# EAGLE design MB128_tester_PCB (EAGLE 9.4.0)
PC Engine Joypad Breakout Version 1.0
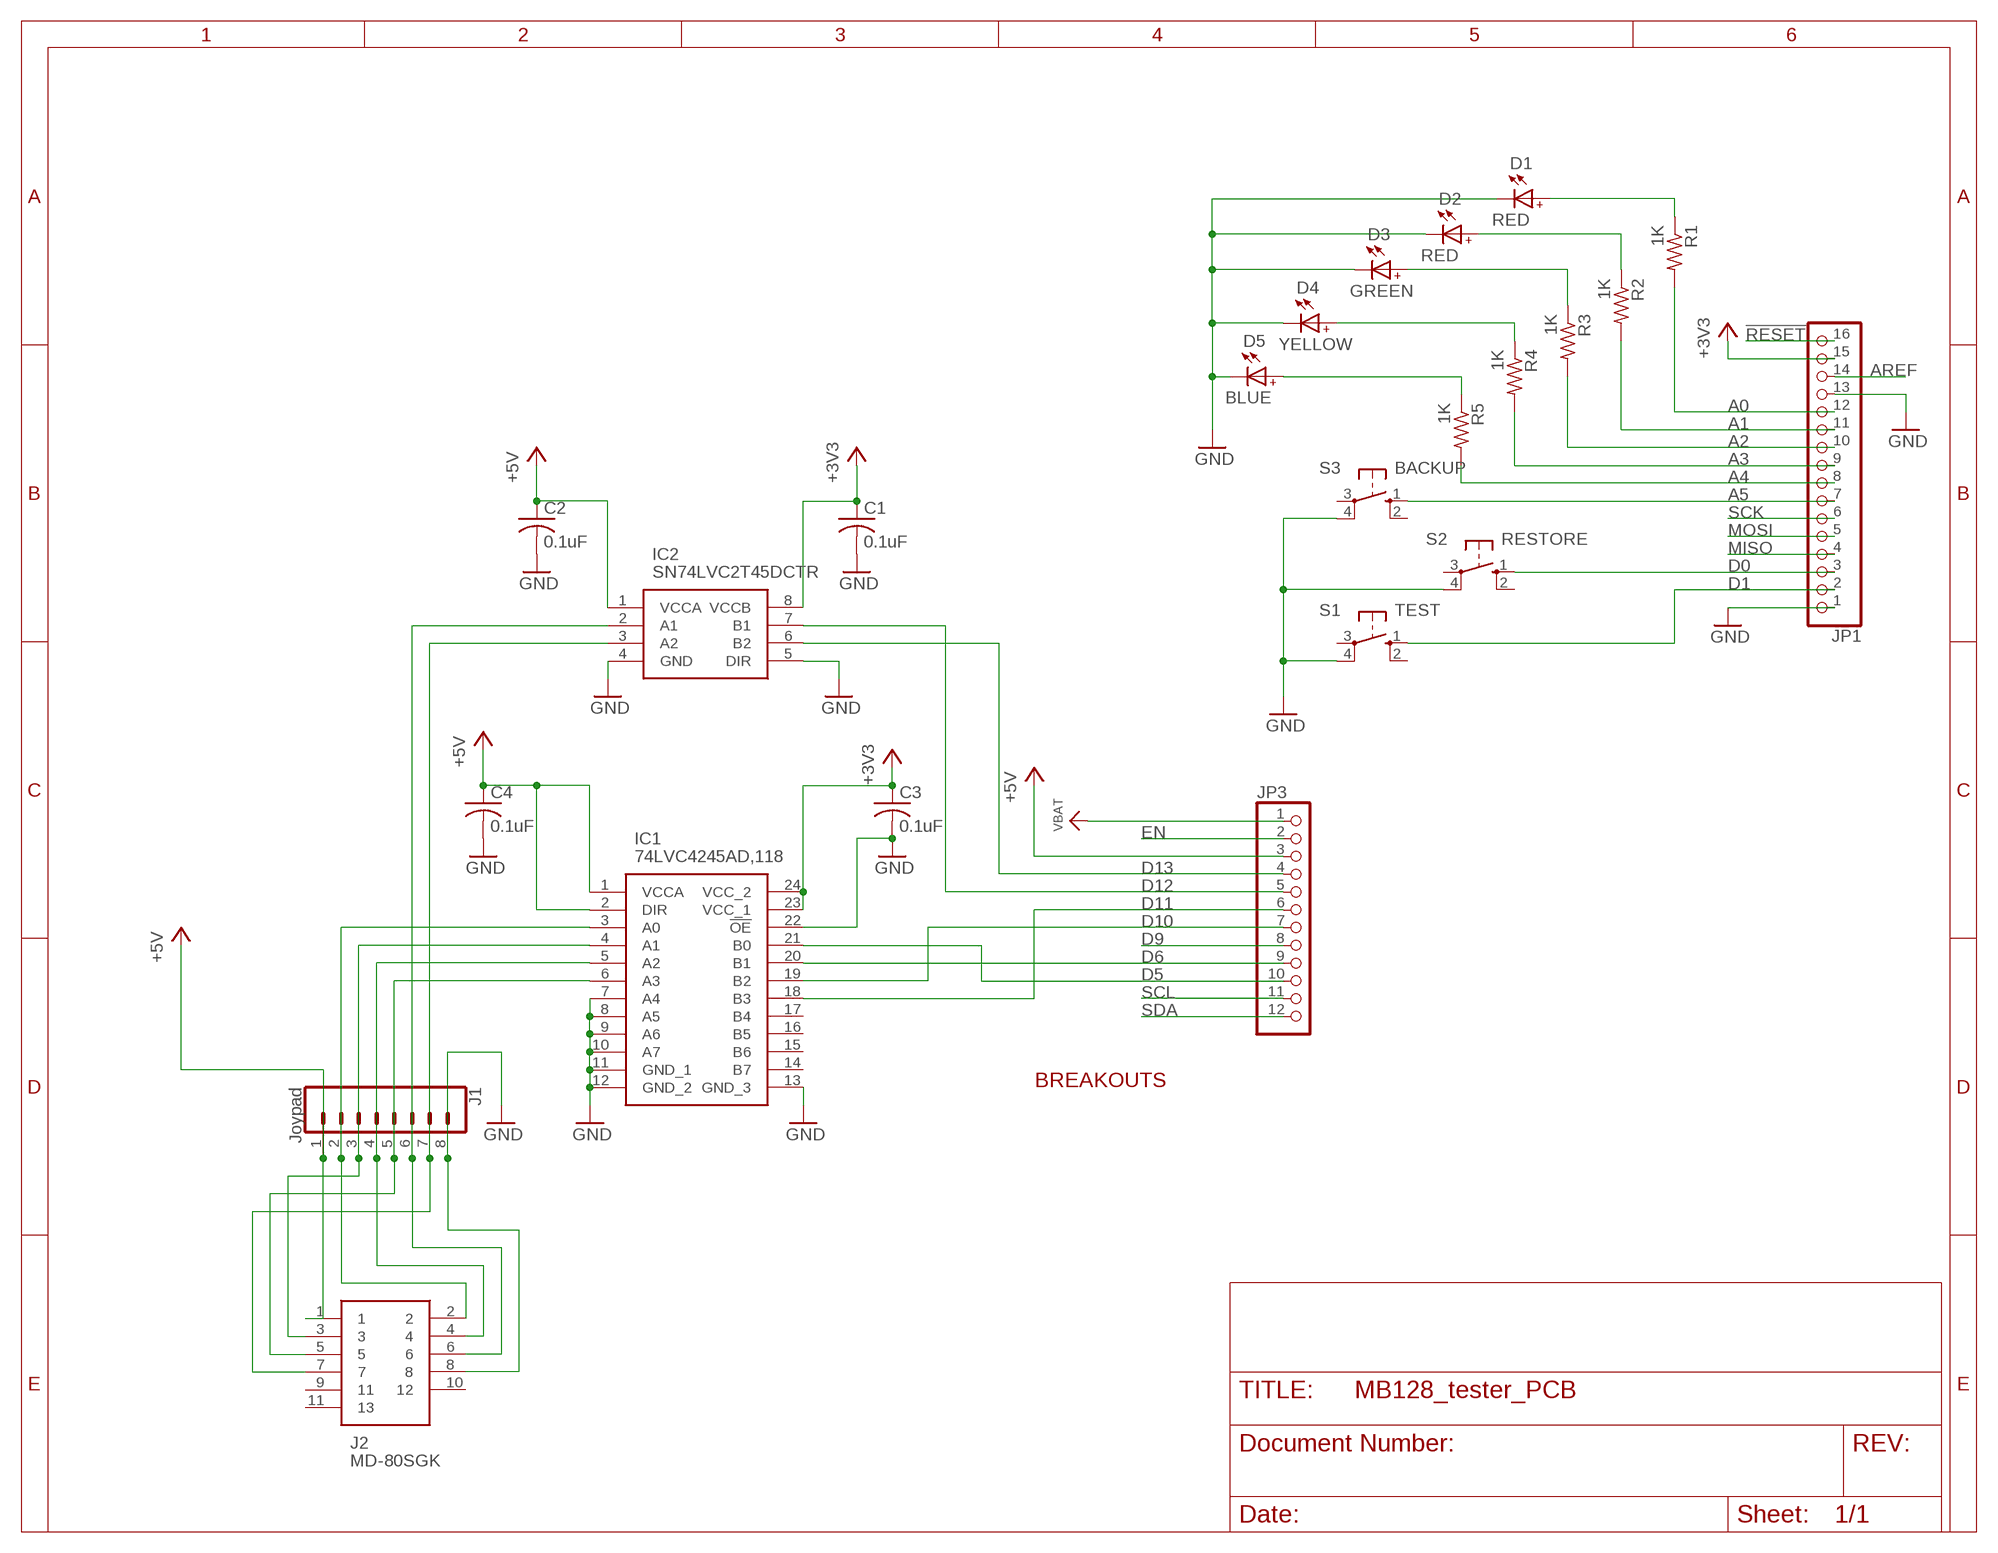
[diagram p0: schematic, sheet 1]

## Parts
C1  0.1uF  C-USC0805  [C0805]
C2  0.1uF  C-USC0805  [C0805]
C3  0.1uF  C-USC0805  [C0805]
C4  0.1uF  C-USC0805  [C0805]
D1  RED  WL-SMCC_0603_R/V/Y_150060RS73220  [WL-SMCC_0603_R/Y/V]
D2  RED  WL-SMCC_0603_R/V/Y_150060RS73220  [WL-SMCC_0603_R/Y/V]
D3  GREEN  WL-SMCC_0603_R/V/Y_150060RS73220  [WL-SMCC_0603_R/Y/V]
D4  YELLOW  WL-SMCC_0603_R/V/Y_150060RS73220  [WL-SMCC_0603_R/Y/V]
D5  BLUE  WL-SMCC_0603_R/V/Y_150060RS73220  [WL-SMCC_0603_R/Y/V]
IC1  74LVC4245AD,118  [SOIC127P1032X265-24N]
IC2  SN74LVC2T45DCTR  [SOP65P400X130-8N]
J1  Joypad  CONN_08"  [1X08]
J2  MD-80SGK  [MD80SGK]
JP1  HEADER-1X16ROUND  [1X16_ROUND]
JP3  HEADER-1X12  [1X12_ROUND]
R1  1K  R-US_R0603  [R0603]
R2  1K  R-US_R0603  [R0603]
R3  1K  R-US_R0603  [R0603]
R4  1K  R-US_R0603  [R0603]
R5  1K  R-US_R0603  [R0603]
S1  TEST  10-XX  [B3F-10XX]
S2  RESTORE  10-XX  [B3F-10XX]
S3  BACKUP  10-XX  [B3F-10XX]

## Nets
!RESET: JP1.16
+3V3 [power]: C1.1 C3.1 IC1.23(VCC_1) IC1.24(VCC_2) IC2.8(VCCB) JP1.15
+5V [power]: C2.1 C4.1 IC1.1(VCCA) IC1.2(DIR) IC2.1(VCCA) J1.1 J2.1 JP3.3
A0: JP1.12 R1.2
A1: JP1.11 R2.2
A2: JP1.10 R3.2
A3: JP1.9 R4.2
A4: JP1.8 R5.2
A5: JP1.7 S3.1(S)
AREF: JP1.14
D0: JP1.3 S2.1(S)
D1: JP1.2 S1.1(S)
D5 [signal]: IC1.21(B0) JP3.10
D6 [signal]: IC1.20(B1) JP3.9
D9: JP3.8
D10 [signal]: IC1.19(B2) JP3.7
D11 [signal]: IC1.18(B3) JP3.6
D12 [signal]: IC2.7(B1) JP3.5
D13 [signal]: IC2.6(B2) JP3.4
EN: JP3.2
GND [power]: C1.2 C2.2 C3.2 C4.2 D1.1(C) D2.1(C) D3.1(C) D4.1(C) D5.1(C) IC1.7(A4) IC1.8(A5) IC1.9(A6) IC1.10(A7) IC1.11(GND_1) IC1.12(GND_2) IC1.13(GND_3) IC1.22(!OE) IC2.4(GND) IC2.5(DIR) J1.8 J2.8 JP1.1 JP1.13 S1.4(P1) S2.4(P1) S3.4(P1)
MISO: JP1.4
MOSI: JP1.5
N$1: D1.2(A) R1.1
N$2 [signal]: IC1.4(A1) J1.3 J2.3
N$3 [signal]: IC1.3(A0) J1.2 J2.2
N$4 [signal]: IC1.5(A2) J1.4 J2.4
N$5 [signal]: IC1.6(A3) J1.5 J2.5
N$6 [signal]: IC2.2(A1) J1.6 J2.6
N$7 [signal]: IC2.3(A2) J1.7 J2.7
N$8: D2.2(A) R2.1
N$9: D3.2(A) R3.1
N$10: D4.2(A) R4.1
N$11: D5.2(A) R5.1
SCK: JP1.6
SCL: JP3.11
SDA: JP3.12
VBAT: JP3.1
Unconnected: IC1.14(B7) IC1.15(B6) IC1.16(B5) IC1.17(B4) J2.9 J2.10 J2.11 S1.2(S1) S1.3(P) S2.2(S1) S2.3(P) S3.2(S1) S3.3(P)

## Notes on the sheet
- BREAKOUTS

## Library data of the parts
C1-C4 = resistor:C-US: CAPACITOR, American symbol
D1-D5 = Wurth_Elektronik_Optoelectronics_rev19a:WL-SMCC_0603_R/V/Y: WL-SMCC SMD Mono-color Chip LED Compact Characteristics Compatible to IR reflow soldering Miniaturized color effect Size 0603 Industrial platform – 1.6 x 0.8 mm Ultra thin 0.2 mm PCB based Temperature Tj = 115°C / 125°C Applications Size 0603 Office Automation Home appliances Industrial equipment Industrial switches and button backlighting Dashboards Entertainment consoles Small pixel indoor signs <http://katalog.we-online.de/media/images/v2/Family_WL-SMCC_neu.jpg> Details see: http://katalog.we-online.de/en/led/WL-SMCC?m Created By Yingchun Shan 2018-03-09 2018 (C) Wurth Elektronik
IC1 = SamacSys_Parts:74LVC4245AD,118: NEXPERIA - 74LVC4245AD,118 - TRANSCEIVER, NON-INVERTING, SOIC-24 Source: Datasheet <https://assets.nexperia.com/documents/data-sheet/74LVC4245A.pdf>; DESCRIPTION: NEXPERIA - 74LVC4245AD,118 - TRANSCEIVER, NON-INVERTING, SOIC-24; HEIGHT: 2.65mm; MANUFACTURER_NAME: Nexperia; MANUFACTURER_PART_NUMBER: 74LVC4245AD,118; MOUSER_PART_NUMBER: 771-74LVC4245AD-T; MOUSER_PRICE-STOCK: https://www.mouser.com/Search/Refine.aspx?Keyword=771-74LVC4245AD-T; RS_PART_NUMBER: 1708039; RS_PRICE-STOCK: http://uk.rs-online.com/web/p/products/1708039
IC2 = SamacSys_Parts:SN74LVC2T45DCTR: 2-Bit Bus Transceiver, Translation SSOP8 SN74LVC2T45DCTR, Voltage Level Translator, Bus Transceiver LVC, 3-State 1.65 Source: Datasheet <http://www.ti.com/lit/ds/symlink/sn74lvc2t45.pdf>; DESCRIPTION: 2-Bit Bus Transceiver, Translation SSOP8 SN74LVC2T45DCTR, Voltage Level Translator, Bus Transceiver LVC, 3-State 1.65; HEIGHT: 1.3mm; MANUFACTURER_NAME: Texas Instruments; MANUFACTURER_PART_NUMBER: SN74LVC2T45DCTR; MOUSER_PART_NUMBER: 595-SN74LVC2T45DCTR; MOUSER_PRICE-STOCK: https://www.mouser.com/Search/Refine.aspx?Keyword=595-SN74LVC2T45DCTR; RS_PART_NUMBER: 9213022; RS_PRICE-STOCK: http://uk.rs-online.com/web/p/products/9213022
J1 = SparkFun-Connectors:CONN_08: Multi connection point. Often used as Generic Header-pin footprint for 0.1 inch spaced/style header connections On any of the 0.1 inch spaced packages, you can populate with these: Break Away Headers - Straight <https://www.sparkfun.com/products/116> (PRT-00116) Break Away Male Headers - Right Angle <https://www.sparkfun.com/products/553> (PRT-00553) Female Headers <https://www.sparkfun.com/products/115> (PRT-00115) Break Away Headers - Machine Pin <https://www.sparkfun.com/products/117> (PRT-00117) Break Away Female Headers - Swiss Machine Pin <https://www.sparkfun.com/products/743> (PRT-00743) Arduino Stackable Header - 8 Pin <https://www.sparkfun.com/products/9279> (PRT-09279) For SCREWTERMINALS and SPRING TERMINALS visit here: Screw Terimnals on SparkFun.com <https://www.sparkfun.com/search/results?term=Screw+Terminals> (5mm/3.5mm/2.54mm spacing) This device is also useful as a general connection point to wire up your design to another part of your project. Our various solder wires solder well into these plated through hole pads. Hook-Up Wire - Assortment (Stranded, 22 AWG) <https://www.sparkfun.com/products/11375> (PRT-11375) Hook-Up Wire - Assortment (Solid Core, 22 AWG) <https://www.sparkfun.com/products/11367> (PRT-11367) View the entire wire category on our website here <https://www.sparkfun.com/categories/141> Special notes: Molex polarized connector foot print use with SKU : PRT-08231 with associated crimp pins and housings. 1MM SMD Version SKU: PRT-10208 NOTES ON THE VARIANTS LOCK and LOCK_LONGPADS... This footprint was designed to help hold the alignment of a through-hole component (i.e. 6-pin header) while soldering it into place. You may notice that each hole has been shifted either up or down by 0.005 of an inch from it's more standard position (which is a perfectly straight line). This slight alteration caused the pins (the squares in the middle) to touch the edges of the holes. Because they are alternating, it causes a "brace" to hold the component in place. 0.005 has proven to be the perfect amount of "off-center" position when using our standard breakaway headers. Although looks a little odd when you look at the bare footprint, once you have a header in there, the alteration is very hard to notice. Also,if you push a header all the way into place, it is covered up entirely on the bottom side.; PROD_ID: CONN-08438
J2 = SamacSys_Parts:MD-80SGK: Circular DIN Connectors mini-DIN, 8P jack, rt, through hole, full shield Source: Datasheet <https://www.cui.com/product/resource/md-sgk-series.pdf>; DESCRIPTION: Circular DIN Connectors mini-DIN, 8P jack, rt, through hole, full shield; HEIGHT: 13mm; MANUFACTURER_NAME: CUI; MANUFACTURER_PART_NUMBER: MD-80SGK; MOUSER_PART_NUMBER: 490-MD-80SGK; MOUSER_PRICE-STOCK: https://www.mouser.com/Search/Refine.aspx?Keyword=490-MD-80SGK
JP1 = microbuilder:HEADER-1X16: PIN HEADER
JP3 = microbuilder:HEADER-1X12
R1-R5 = resistor:R-US_: RESISTOR, American symbol
S1-S3 = switch-omron:10-XX: OMRON SWITCH; MPN: B3F-1000; OC_FARNELL: 176432; OC_NEWARK: 36M3542

## Net classes
0 default: width 0.152 mm, drill 0.356 mm, clearance 0.152 mm
1 power: width 0.203 mm, drill 0.356 mm, clearance 0.152 mm
2 signal: width 0.152 mm, drill 0.356 mm, clearance 0.152 mm

## Board
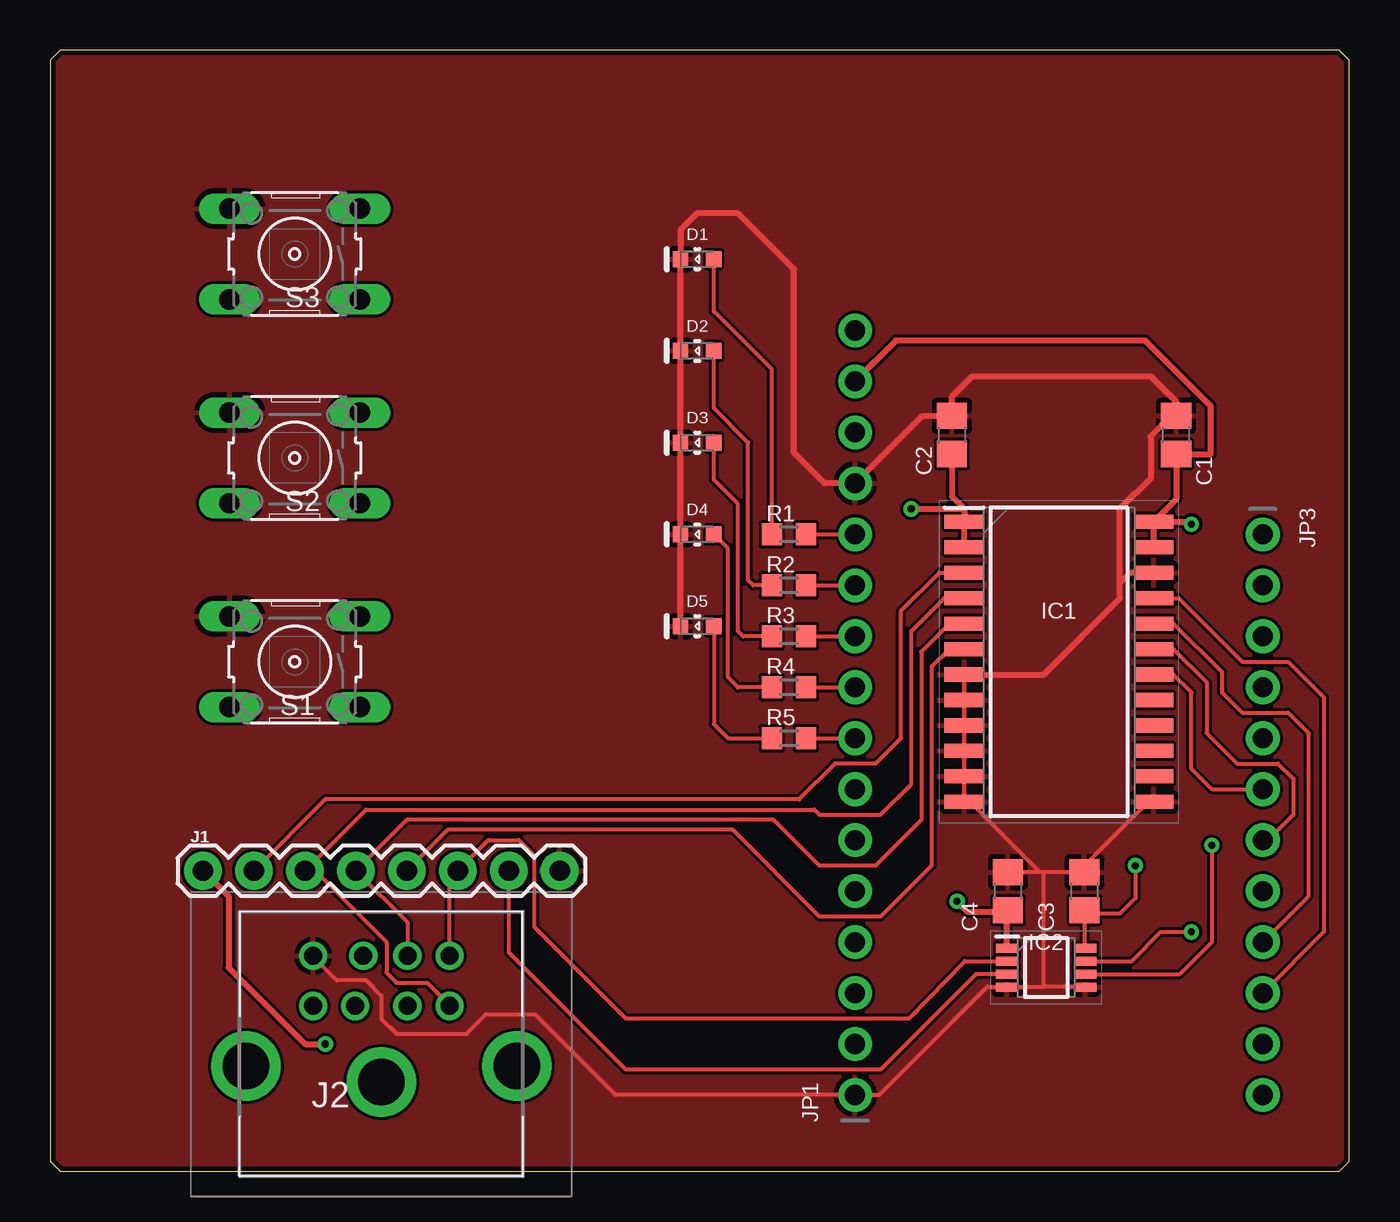
[diagram p1: board, top side]
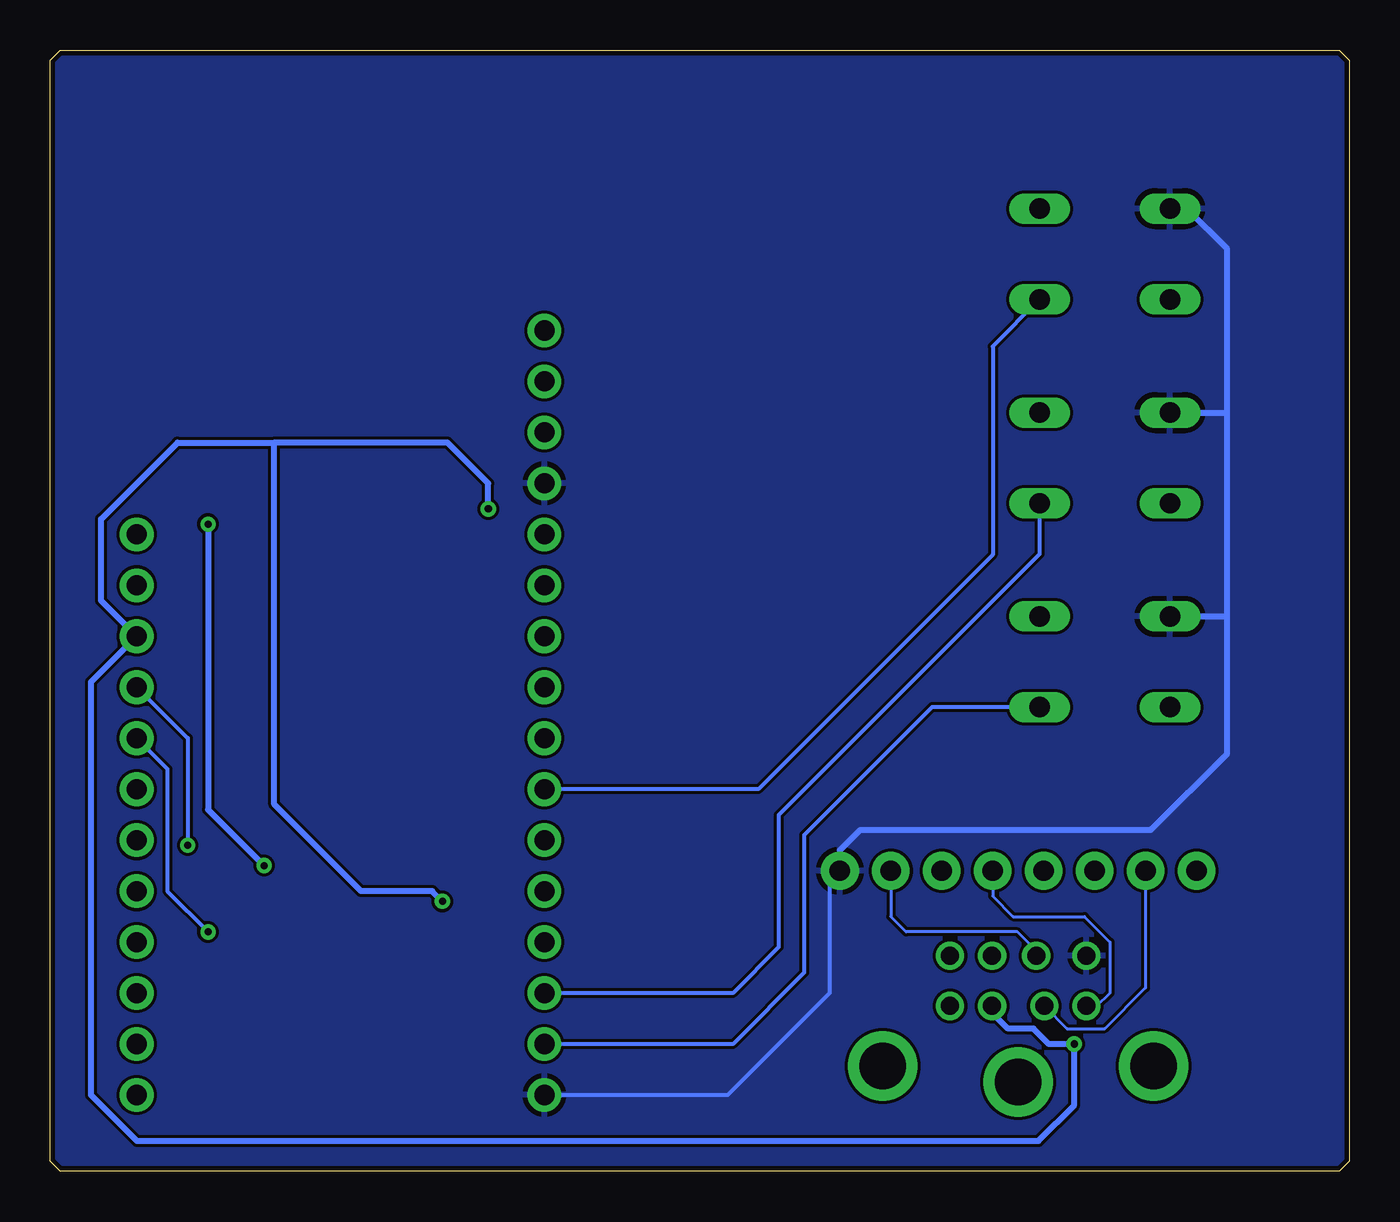
[diagram p2: board, bottom side, seen from below]

Size 64.77 x 55.88 mm. Coordinates in mm from the lower left corner, seen from the top.
Outline: 0,55.37 0,0.51 0.51,0 64.26,0 64.77,0.51 64.77,55.37 64.26,55.88 0.51,55.88 0,55.37
Copper layers (1*16): Top 0.035mm / dielectric 1.5mm / Bottom 0.035mm
Design rules "default *": minimum track width 6mil, minimum drill 0.35mm, track to track 6mil, track to pad 6mil, pad to pad 6mil, via to via 6mil, smd to smd 6mil, copper to edge 10mil, drill to drill 6mil, minimum pad ring 10mil, minimum via ring 8mil, stop-mask expansion 6mil, vias tented up to drill 0mil, thermal gap 10mil

### Footprints (pad centres in the part's own frame; a part is rotated, then mirrored left to right if it is on the bottom)
C0805 = smd 1.3 x 1.5: 1 -0.95,0; 2 0.95,0
WL-SMCC_0603_R/Y/V = smd 0.75 x 0.8: 1 -0.825,0; 2 0.825,0
SOIC127P1032X265-24N = smd 1.95 x 0.7: 1 -4.725,6.985; 2 -4.725,5.715; 3 -4.725,4.445; 4 -4.725,3.175; 5 -4.725,1.905; 6 -4.725,0.635; 7 -4.725,-0.635; 8 -4.725,-1.905; 9 -4.725,-3.175; 10 -4.725,-4.445; 11 -4.725,-5.715; 12 -4.725,-6.985; 13 4.725,-6.985; 14 4.725,-5.715; 15 4.725,-4.445; 16 4.725,-3.175; 17 4.725,-1.905; 18 4.725,-0.635; 19 4.725,0.635; 20 4.725,1.905; 21 4.725,3.175; 22 4.725,4.445; 23 4.725,5.715; 24 4.725,6.985
SOP65P400X130-8N = smd 1.1 x 0.45: 1 -1.95,0.975; 2 -1.95,0.325; 3 -1.95,-0.325; 4 -1.95,-0.975; 5 1.95,-0.975; 6 1.95,-0.325; 7 1.95,0.325; 8 1.95,0.975
1X08 = drill 1.016 pad 1.88: 1 0,0; 2 2.54,0; 3 5.08,0; 4 7.62,0; 5 10.16,0; 6 12.7,0; 7 15.24,0; 8 17.78,0
MD80SGK = drill 0.9 pad 1.4: 1 -1.3,-1.9; 2 1.3,-1.9; 3 -3.4,-1.9; 4 -1.3,-4.4; 5 3.4,-1.9; 6 -3.4,-4.4; 7 0.9,-4.4; 8 3.4,-4.4 | drill 2.309 pad 3.463: 9 0,1.9; 10 -6.75,1.1; 11 6.75,1.1
1X16_ROUND = drill 1 pad 1.676: 1 -19.05,0; 2 -16.51,0; 3 -13.97,0; 4 -11.43,0; 5 -8.89,0; 6 -6.35,0; 7 -3.81,0; 8 -1.27,0; 9 1.27,0; 10 3.81,0; 11 6.35,0; 12 8.89,0; 13 11.43,0; 14 13.97,0; 15 16.51,0; 16 19.05,0
1X12_ROUND = drill 1 pad 1.676: 1 -13.97,0; 2 -11.43,0; 3 -8.89,0; 4 -6.35,0; 5 -3.81,0; 6 -1.27,0; 7 1.27,0; 8 3.81,0; 9 6.35,0; 10 8.89,0; 11 11.43,0; 12 13.97,0
R0603 = smd 1 x 1.1: 1 -0.85,0; 2 0.85,0
B3F-10XX = drill 1.016 long: 1 -3.251,2.261; 2 3.251,2.261; 3 -3.251,-2.261; 4 3.251,-2.261

### Placement (x,y rotation side)
C1  56.13,36.7 90 top
C2  44.96,36.7 90 top
C3  51.56,13.97 90 top
C4  47.75,13.97 90 top
D1  32.26,45.47 0 top
D2  32.26,40.89 0 top
D3  32.26,36.32 0 top
D4  32.26,31.75 0 top
D5  32.26,27.18 0 top
IC1  50.29,25.4 0 top
IC2  49.66,10.16 0 top
J1  7.62,14.99 0 top
J2  16.51,6.35 180 top
JP1  40.13,22.86 90 top
JP3  60.45,17.78 270 top
R1  36.83,31.75 0 top
R2  36.83,29.21 0 top
R3  36.83,26.67 0 top
R4  36.83,24.13 0 top
R5  36.83,21.59 0 top
S1  12.19,25.4 180 top
S2  12.19,35.56 180 top
S3  12.19,45.72 180 top

### Tracks (layer width: path | path; a pad name or v marks a point on that pad's centre or on a via)
+3V3  (via drill 0.36)
  Top 0.203: IC2.8 51.56,11.11 C3.1 51.73,12.85 53.34,12.85 54.1,13.61 v54.1,15.24
  Top 0.305: v56.9,32.26 56.77,32.38 IC1.24 | JP1.15 42.16,41.4 54.61,41.4 57.85,38.16 57.85,35.75 C1.1 56.13,33.5 IC1.24 | IC1.23 IC1.24
  Bottom 0.305: v54.1,15.24 56.9,18.03 v56.9,32.26
+5V  (via drill 0.36)
  Top 0.305: 45.57,33.02 IC1.1 IC1.2 | v42.93,33.02 45.57,33.02 | v13.72,6.35 12.7,6.35 8.89,10.16 8.89,13.72 J1.1 | v45.21,13.46 45.72,12.95 47.69,12.95 | 47.69,12.95 C4.1 | IC2.1 47.71,12.93 47.69,12.95 | 45.57,33.02 44.96,33.63 C2.1
  Bottom 0.305: 53.59,36.32 58.42,36.32 62.23,32.51 62.23,28.45 JP3.3 62.74,24.38 62.74,3.81 60.45,1.52 15.49,1.52 13.72,3.3 v13.72,6.35 14.99,6.35 15.75,7.11 17.02,7.11 17.81,7.9 J2.1 | v45.21,13.46 45.72,13.97 49.28,13.97 53.59,18.29 53.59,36.32 | v42.93,33.02 42.93,34.29 44.96,36.32 53.59,36.32
A0
  Top 0.203: R1.2 JP1.12
A1
  Top 0.203: R2.2 JP1.11
A2
  Top 0.203: R3.2 JP1.10
A3
  Top 0.203: R4.2 JP1.9
A4
  Top 0.203: R5.2 JP1.8
A5
  Bottom 0.203: S3.1 17.78,41.12 17.78,30.73 29.46,19.05 JP1.7
D0
  Bottom 0.203: S2.1 15.44,30.76 28.45,17.75 28.45,11.18 30.73,8.89 JP1.3
D1
  Bottom 0.203: S1.1 20.8,23.14 27.18,16.76 27.18,9.91 30.73,6.35 JP1.2
D5
  Top 0.203: IC1.21 56.26,28.57 59.44,25.4 61.72,25.4 63.5,23.62 63.5,11.94 JP3.10
D6
  Top 0.203: IC1.20 56.01,27.3 58.42,24.89 58.42,23.88 59.44,22.86 61.72,22.86 62.74,21.84 62.74,13.72 JP3.9
D10
  Top 0.203: IC1.19 56.01,26.04 57.66,24.38 57.66,21.84 59.18,20.32 61.21,20.32 61.98,19.56 61.98,17.78 60.71,16.51 JP3.7
D11
  Top 0.203: JP3.6 57.91,19.05 56.9,20.07 56.9,23.88 56.01,24.77 IC1.18
D12  (via drill 0.36)
  Top 0.203: v56.9,11.94 55.37,11.94 53.92,10.48 IC2.7
  Bottom 0.203: JP3.5 58.93,20.07 58.93,13.97 v56.9,11.94
D13  (via drill 0.36)
  Top 0.203: v57.91,16.26 57.91,11.43 56.32,9.84 IC2.6
  Bottom 0.203: JP3.4 57.91,21.59 v57.91,16.26
GND
  Top 0.203: 51.24,14.92 C3.2 51.24,14.92 | 51.24,14.92 49.53,14.92 | 49.53,14.92 49.34,14.92 | 49.34,14.92 C4.2 | 51.24,14.92 54.74,18.41 IC1.13 | 49.34,14.92 45.85,18.41 IC1.12 IC1.11 IC1.10 IC1.9 IC1.8 IC1.7 | 49.53,9.21 51.56,9.21 IC2.5 | 49.53,9.21 47.75,9.21 IC2.4 47.43,9.21 46.74,9.21 41.34,3.81 JP1.1 28.19,3.81 24.19,7.81 21.72,7.81 20.77,6.86 17.27,6.86 16.51,7.62 16.51,8.76 15.75,9.53 14.29,9.53 13.34,10.48 J2.8 | 49.53,9.21 49.53,14.92
  Top 0.305: 53.34,29.34 53.85,29.84 IC1.22 | 53.34,29.34 53.34,28.57 49.53,24.77 IC1.7 | 53.34,29.34 53.34,33.02 54.86,34.54 54.86,36.64 55.88,37.65 C1.2 56.13,38.35 54.86,39.62 45.97,39.62 44.96,38.61 C2.2 43.49,37.65 JP1.13 38.61,34.29 37.08,35.81 37.08,44.96 34.29,47.75 32.26,47.75 31.43,46.93 D1.1 D2.1 D3.1 D4.1 D5.1
  Bottom 0.203: J1.8 25.91,14.48 25.91,8.89 30.99,3.81 JP1.1
  Bottom 0.305: J1.8 25.4,16 24.38,17.02 9.91,17.02 6.1,20.83 6.1,27.69 | 6.1,27.69 6.1,37.85 | 6.1,37.85 6.1,45.97 8.1,47.98 S3.4 | S1.4 6.12,27.66 6.1,27.69 | S2.4 6.12,37.82 6.1,37.85
  pour Bottom: -0.38,56.13 65.28,56.13 65.28,-0.38 -0.38,-0.38
  pour Top: -0.76,-0.25 -0.76,56.39 65.53,56.39 65.53,-0.25
N$1
  Top 0.203: D1.2 33.08,42.86 35.98,39.97 R1.1
N$2
  Top 0.203: J2.3 19.91,8.28 18.8,9.4 17.27,9.4 16.76,9.91 16.76,11.43 13.21,14.99 J1.3 15.75,18.03 38.1,18.03 38.35,17.78 41.4,17.78 42.93,19.3 42.93,26.92 44.58,28.57 IC1.4
N$3
  Top 0.203: IC1.3 44.32,29.84 42.42,27.94 42.42,21.59 41.15,20.32 39.12,20.32 37.34,18.54 13.72,18.54 J1.2
  Bottom 0.152: J2.2 14.07,7.11 12.19,7.11 10.16,9.14 J1.2
N$4
  Top 0.203: IC1.5 44.83,27.3 43.43,25.91 43.43,17.53 41.15,15.24 38.35,15.24 36.07,17.53 17.78,17.53 J1.4 17.81,12.42 J2.4
N$5
  Top 0.203: J1.5 19.81,17.02 34.04,17.02 38.35,12.7 41.4,12.7 43.94,15.24 43.94,25.15 44.83,26.04 IC1.6
  Bottom 0.152: J1.5 17.78,13.72 16.76,12.7 13.21,12.7 11.94,11.43 11.94,8.89 12.58,8.25 J2.5
N$6
  Top 0.203: IC2.2 45.6,10.48 42.8,7.62 28.7,7.62 24.13,12.19 24.13,15.75 23.37,16.51 21.84,16.51 J1.6 19.91,14.58 J2.6
N$7
  Top 0.203: J1.7 22.86,10.92 28.7,5.08 41.4,5.08 46.16,9.84 IC2.3
  Bottom 0.152: J2.7 15.61,11 16.54,11.94 22.1,11.94 22.86,12.7 J1.7
N$8
  Top 0.203: R2.1 35.05,29.21 34.8,29.46 34.8,36.32 33.08,38.04 D2.2
N$9
  Top 0.203: R3.1 34.54,26.67 34.29,26.92 34.29,33.27 33.08,34.48 D3.2
N$10
  Top 0.203: R4.1 34.29,24.13 33.78,24.64 33.78,31.05 D4.2
N$11
  Top 0.203: R5.1 33.78,21.59 33.08,22.29 D5.2

### Text on the board
tValues: PCE Memory Base 128 Tester, rev. C | (C) 2019 David Shadoff | +5V | D0 | D1 | D2 | D3 | SEL | CLR | GND
tDocu: BACKUP | SD ERR | MB128 ERR | RESTORE | READ | WRITE | TEST OK | TEST